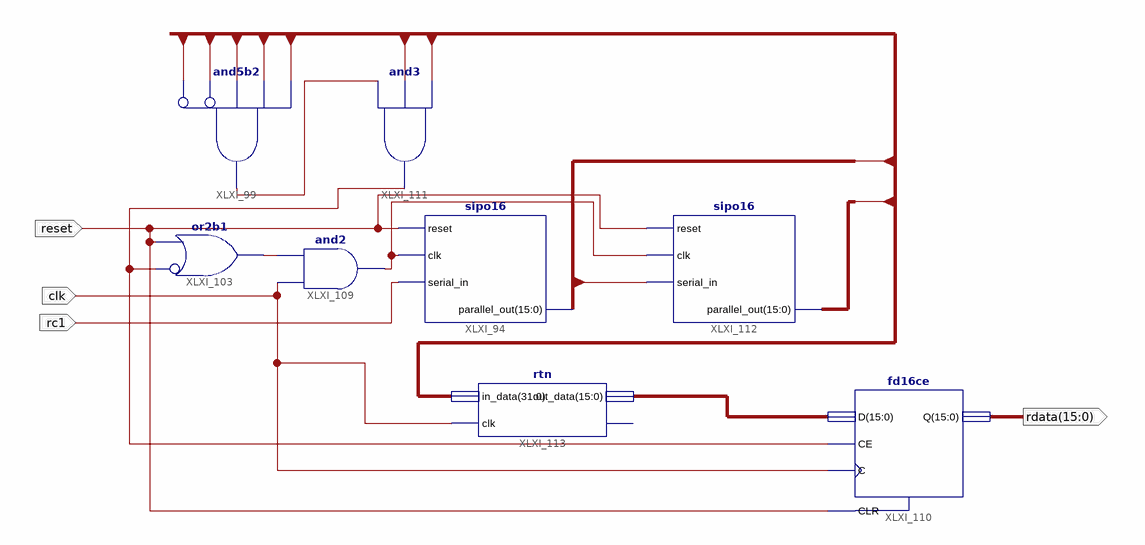
[diagram p0: schematic sheet 1]
// Xilinx ISE schematic receiver.sch (spartan6) as structural Verilog: 8 symbols, 4 ports
module receiver (
  input  rc1,
  input  reset,
  input  clk,
  output [15:0] rdata
);

  wire XLXN_72, XLXN_84, XLXN_108, XLXN_113;
  wire [15:0] XLXN_170;
  wire [31:0] rec_data;

  and XLXI_99 (XLXN_108, ~rec_data[30], ~rec_data[28], rec_data[31], rec_data[29], rec_data[27]);  // and5b2
  sipo16 XLXI_94 (.reset(reset), .clk(XLXN_84), .serial_in(rc1), .parallel_out(rec_data[15:0]));
  or XLXI_103 (XLXN_72, ~XLXN_113, reset);  // or2b1
  and XLXI_109 (XLXN_84, clk, XLXN_72);
  and XLXI_111 (XLXN_113, XLXN_108, rec_data[1], rec_data[0]);
  fd16ce XLXI_110 (.C(clk), .CE(XLXN_113), .CLR(reset), .D(XLXN_170), .Q(rdata));
  sipo16 XLXI_112 (.reset(reset), .clk(XLXN_84), .serial_in(rec_data[15]), .parallel_out(rec_data[31:16]));
  rtn XLXI_113 (.in_data(rec_data), .clk(clk), .out_data(XLXN_170));  // open: valid
endmodule
